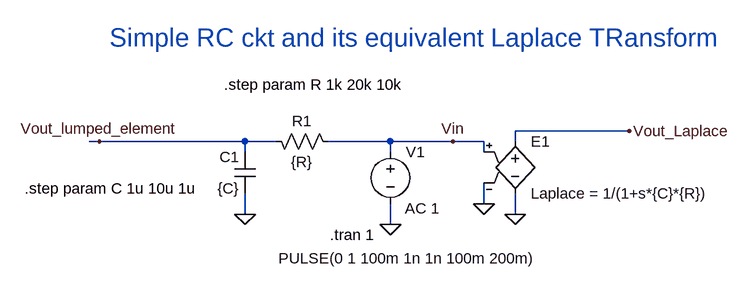
[diagram p0: schematic Simple RC ckt and its equivalent Laplace TRansform.asc]
Simple RC ckt and its equivalent Laplace TRansform.asc, the LTspice schematic file:
Version 4
SHEET 1 880 680
WIRE 320 144 144 144
WIRE -496 160 -512 160
WIRE -272 160 -496 160
WIRE -224 160 -272 160
WIRE -48 160 -144 160
WIRE 48 160 -48 160
WIRE 96 160 48 160
WIRE 144 160 144 144
WIRE -272 176 -272 160
WIRE -48 176 -48 160
WIRE 96 176 96 160
WIRE 96 256 96 224
WIRE -272 272 -272 240
WIRE 144 272 144 240
WIRE -48 288 -48 256
FLAG 144 272 0
FLAG 96 256 0
FLAG -48 288 0
FLAG -272 272 0
FLAG 48 160 Vin
FLAG -496 160 Vout_lumped_element
FLAG 320 144 Vout_Laplace
SYMBOL e 144 144 R0
SYMATTR InstName E1
SYMATTR Value Laplace = 1/(1+s*{C}*{R})
SYMBOL voltage -48 160 R0
WINDOW 3 -172 180 Left 2
WINDOW 123 22 103 Left 2
WINDOW 39 0 0 Left 0
SYMATTR InstName V1
SYMATTR Value PULSE(0 1 100m 1n 1n 100m 200m)
SYMATTR Value2 AC 1
SYMBOL res -240 144 M90
WINDOW 0 0 56 VBottom 2
WINDOW 3 32 56 VTop 2
SYMATTR InstName R1
SYMATTR Value {R}
SYMBOL cap -256 176 M0
SYMATTR InstName C1
SYMATTR Value {C}
TEXT -304 72 Left 2 !.step param R 1k 20k 10k
TEXT -344 232 Right 2 !.step param C 1u 10u 1u
TEXT -480 0 Left 4 ;Simple RC ckt and its equivalent Laplace TRansform
TEXT -72 304 Right 2 !.tran 1

The netlist it stands for:
* Simple RC ckt and its equivalent Laplace TRansform.asc
E1 Vout_Laplace 0 Vin 0 Laplace = 1/(1+s*{C}*{R})
V1 Vin 0 PULSE(0 1 100m 1n 1n 100m 200m) AC 1
R1 Vout_lumped_element Vin {R}
C1 Vout_lumped_element 0 {C}
.step param R 1k 20k 10k
.step param C 1u 10u 1u
* Simple RC ckt and its equivalent Laplace TRansform
.tran 1
.backanno
.end

* Results of the author's LTspice run, read from the files saved beside the schematic
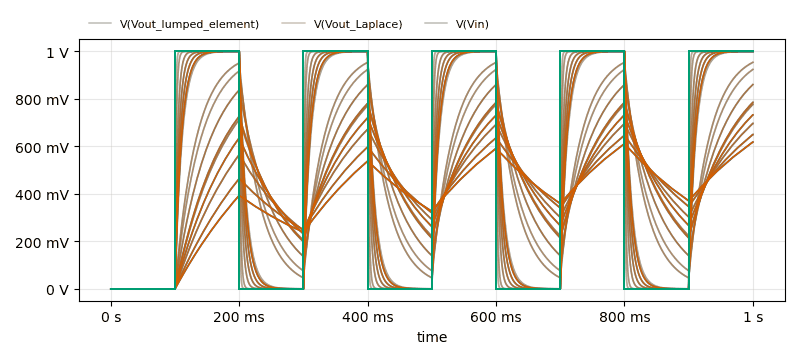
[diagram p1: Transient Analysis of Simple RC ckt and its equivalent Laplace TRansform.asc, plotted from the saved traces]
* Transient Analysis, 30 runs:
*   V(Vout_lumped_element) [run 1]: min 0 V, max 1 V, average 499 mV, rms 703.2 mV, last 1 V
*   V(Vout_lumped_element) [run 2]: min 0 V, max 999.9 mV, average 489 mV, rms 663 mV, last 999.9 mV
*   V(Vout_lumped_element) [run 3]: min 0 V, max 1 V, average 498 mV, rms 699.3 mV, last 1 V
*   V(Vout_lumped_element) [run 4]: min 0 V, max 924.2 mV, average 463 mV, rms 557.4 mV, last 924.2 mV
*   V(Vout_lumped_element) [run 5]: min 0 V, max 953.9 mV, average 468.5 mV, rms 577.9 mV, last 953.9 mV
*   V(Vout_lumped_element) [run 6]: min 0 V, max 1 V, average 496 mV, rms 691.4 mV, last 1 V
*   V(Vout_lumped_element) [run 7]: min 0 V, max 777.3 mV, average 437.8 mV, rms 490.5 mV, last 777.3 mV
*   V(Vout_lumped_element) [run 8]: min 0 V, max 860.4 mV, average 452.7 mV, rms 524.6 mV, last 860.4 mV
*   V(Vout_Laplace) [run 1]: min 0 V, max 1.001 V, average 499.6 mV, rms 704 mV, last 1.001 V
*   V(Vout_Laplace) [run 2]: min 0 V, max 1.001 V, average 489.5 mV, rms 663.7 mV, last 1.001 V
*   V(Vout_Laplace) [run 3]: min 0 V, max 1.001 V, average 498.6 mV, rms 700.1 mV, last 1.001 V
*   V(Vout_Laplace) [run 4]: min 0 V, max 924.9 mV, average 463.5 mV, rms 558 mV, last 924.8 mV
*   V(Vout_Laplace) [run 5]: min 0 V, max 954.9 mV, average 469 mV, rms 578.5 mV, last 954.6 mV
*   V(Vout_Laplace) [run 6]: min 0 V, max 1.001 V, average 496.6 mV, rms 692.2 mV, last 1.001 V
*   V(Vout_Laplace) [run 7]: min 0 V, max 777.9 mV, average 438.3 mV, rms 491 mV, last 777.9 mV
*   V(Vout_Laplace) [run 8]: min 0 V, max 861.2 mV, average 453.2 mV, rms 525.1 mV, last 861 mV
*   V(Vin) [run 1]: min 0 V, max 1 V, average 500 mV, rms 707.1 mV, last 1 V
*   V(Vin) [run 2]: min 0 V, max 1 V, average 500 mV, rms 707.1 mV, last 1 V
*   V(Vin) [run 3]: min 0 V, max 1 V, average 500 mV, rms 707.1 mV, last 1 V
*   V(Vin) [run 4]: min 0 V, max 1 V, average 500 mV, rms 707.1 mV, last 1 V
*   V(Vin) [run 5]: min 0 V, max 1 V, average 500 mV, rms 707.1 mV, last 1 V
*   V(Vin) [run 6]: min 0 V, max 1 V, average 500 mV, rms 707.1 mV, last 1 V
*   V(Vin) [run 7]: min 0 V, max 1 V, average 500 mV, rms 707.1 mV, last 1 V
*   V(Vin) [run 8]: min 0 V, max 1 V, average 500 mV, rms 707.1 mV, last 1 V